# Altium schematic sheet [1] Power_Stage.SchDoc
size A4; SheetNumber: 2; SheetTotal: 5
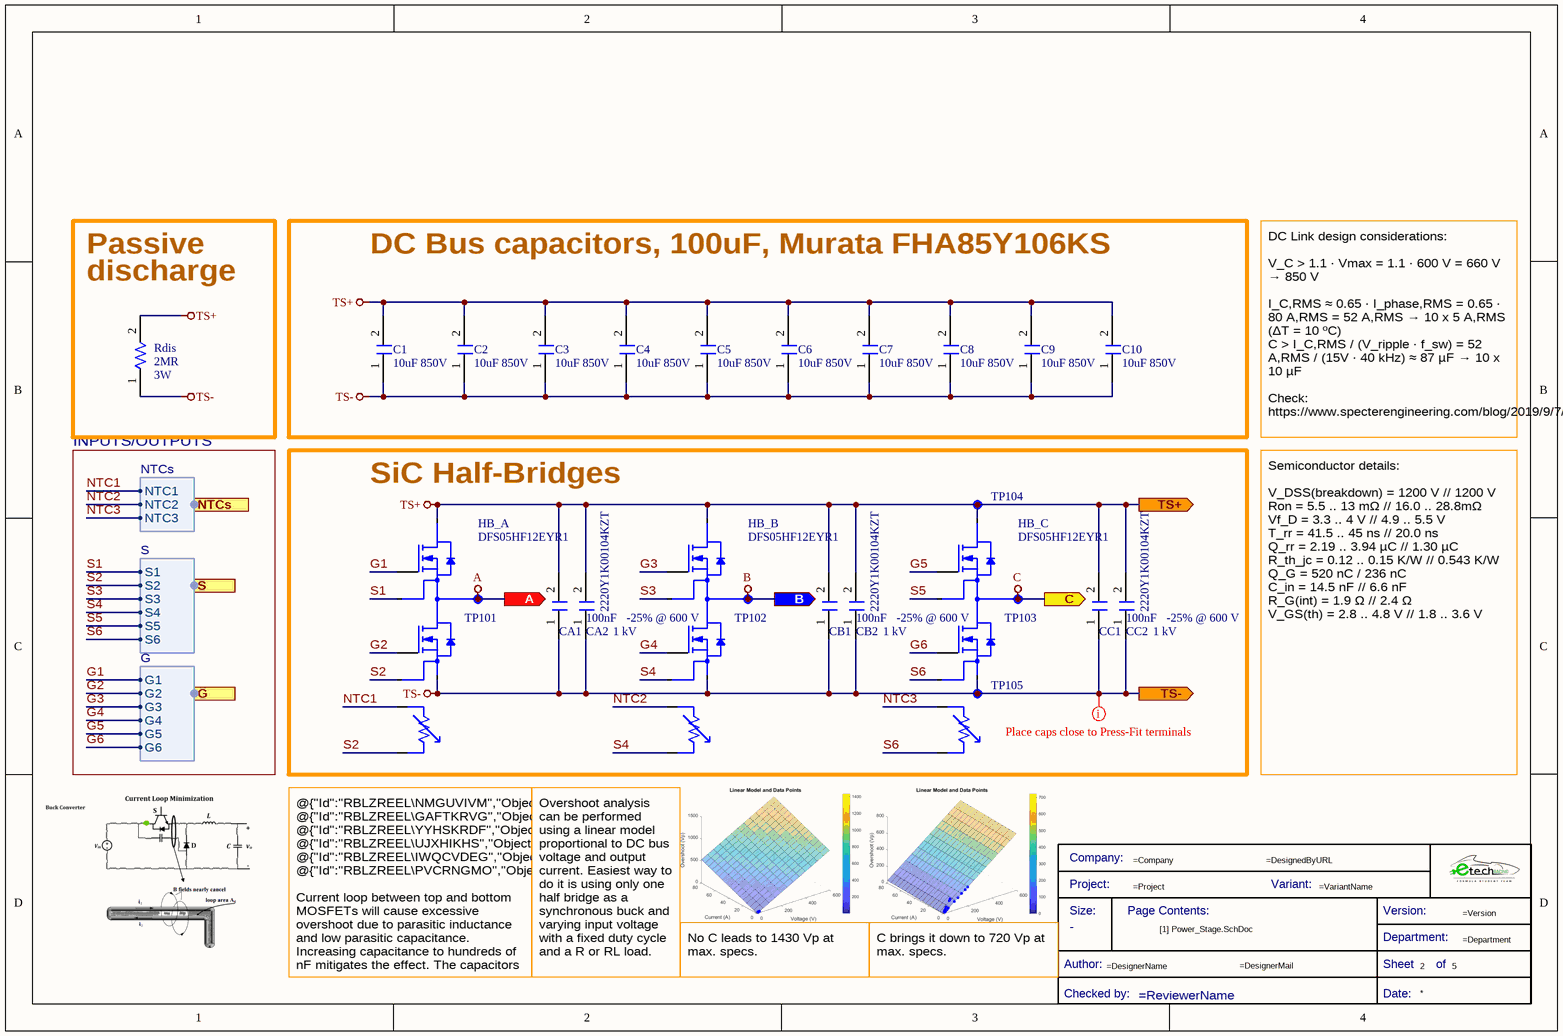
[diagram p0: [1] Power_Stage.SchDoc]

## Parts
*?  Title Block_template  (value not drawn)  (graphical)
C1  10uF 850V  [FHA85Y106KS]
C2  10uF 850V  [FHA85Y106KS]
C3  10uF 850V  [FHA85Y106KS]
C4  10uF 850V  [FHA85Y106KS]
C5  10uF 850V  [FHA85Y106KS]
C6  10uF 850V  [FHA85Y106KS]
C7  10uF 850V  [FHA85Y106KS]
C8  10uF 850V  [FHA85Y106KS]
C9  10uF 850V  [FHA85Y106KS]
C10  10uF 850V  [FHA85Y106KS]
CA1  2220Y1K00104KZT  [CAP_2220]  (value not drawn)
CA2  2220Y1K00104KZT  value 100nF  DC bias: -25% @ 600 V  Voltage rating: 1 kV  [CAP_2220]
CB1  2220Y1K00104KZT  [CAP_2220]  (value not drawn)
CB2  2220Y1K00104KZT  value 100nF  DC bias: -25% @ 600 V  Voltage rating: 1 kV  [CAP_2220]
CC1  2220Y1K00104KZT  [CAP_2220]  (value not drawn)
CC2  2220Y1K00104KZT  value 100nF  DC bias: -25% @ 600 V  Voltage rating: 1 kV  [CAP_2220]
HB_A  DFS05HF12EYR1  [DFS05HF12EYR1]
HB_B  DFS05HF12EYR1  [DFS05HF12EYR1]
HB_C  DFS05HF12EYR1  [DFS05HF12EYR1]
Rdis  Power Rating: 3W  Resistance: 2MR  [R2512FTK]  (hidden comment: R2M-2512FTK)
TP101  TestPoint  [TestPoint]  (value not drawn)  (no BOM)
TP102  TestPoint  [TestPoint]  (value not drawn)  (no BOM)
TP103  TestPoint  [TestPoint]  (value not drawn)  (no BOM)
TP104  TestPoint  [TestPoint]  (value not drawn)  (no BOM)
TP105  TestPoint  [TestPoint]  (value not drawn)  (no BOM)

## Blocks framed on the sheet
DC Bus capacitors, 100uF, Murata FHA85Y106KS: C1-C10
SiC Half-Bridges: CA1 CA2 CB1 CB2 CC1 CC2 HB_A HB_B HB_C TP101-TP105

## Ports
A (out, see Inverter_Power[3C], [2] Current_Sense[2A]), B (out, see Inverter_Power[3C], [2] Current_Sense[2B]), C (out, see Inverter_Power[3C], [2] Current_Sense[2C]), G (harness G, see Inverter_Power[3C], [3] Gate_Drivers[3A]), NTCs (harness NTCs, see Inverter_Power[3C], [3] Gate_Drivers[4A]), S (harness S, see Inverter_Power[3C], [3] Gate_Drivers[3A]), TS+ (out, see Inverter_Power[3C], [4] Half_Bridge[3A], [5] DC[1D]), TS- (out, see Inverter_Power[3C], [5] DC[1D])

## Harnesses
NTCs: NTC1, NTC2, NTC3
S: S1, S2, S3, S4, S5, S6
G: G1, G2, G3, G4, G5, G6

## Nets
A: HB_A.1(AC) TP101.1(TP) ; port A
B: HB_B.1(AC) TP102.1(TP) ; port B
C: HB_C.1(AC) TP103.1(TP) ; port C
TS+: C1.2 C2.2 C3.2 C4.2 C5.2 C6.2 C7.2 C8.2 C9.2 C10.2 CA1.2 CA2.2 CB1.2 CB2.2 CC1.2 CC2.2 HB_A.4(DC+) HB_B.4(DC+) HB_C.4(DC+) Rdis.2 TP104.1(TP) ; port TS+
TS-: C1.1 C2.1 C3.1 C4.1 C5.1 C6.1 C7.1 C8.1 C9.1 C10.1 CA1.1 CA2.1 CB1.1 CB2.1 CC1.1 CC2.1 HB_A.5(DC-) HB_B.5(DC-) HB_C.5(DC-) Rdis.1 TP105.1(TP) ; port TS-
G1: HB_A.6(G1) ; port G.G1
G2: HB_A.3(G2) ; port G.G2
G3: HB_B.6(G1) ; port G.G3
G4: HB_B.3(G2) ; port G.G4
G5: HB_C.6(G1) ; port G.G5
G6: HB_C.3(G2) ; port G.G6
NTC1: HB_A.9(T2) ; port NTCs.NTC1
NTC2: HB_B.9(T2) ; port NTCs.NTC2
NTC3: HB_C.9(T2) ; port NTCs.NTC3
S1: HB_A.7(S1) ; port S.S1
S2: HB_A.2(S2) HB_A.8(T1) ; port S.S2
S3: HB_B.7(S1) ; port S.S3
S4: HB_B.2(S2) HB_B.8(T1) ; port S.S4
S5: HB_C.7(S1) ; port S.S5
S6: HB_C.2(S2) HB_C.8(T1) ; port S.S6

## Layout directives
mark named Place caps close to Press-Fit terminals: TS-

## Notes on the sheet
- Passive
- discharge
- INPUTS/OUTPUTS
- DC Link design considerations:
  V_C > 1.1 · Vmax = 1.1 · 600 V = 660 V → 850 V
  I_C,RMS ≈ 0.65 · I_phase,RMS = 0.65 · 80 A,RMS = 52 A,RMS → 10 x 5 A,RMS (ΔT = 10 ºC)
  C > I_C,RMS / (V_ripple · f_sw) = 52 A,RMS / (15V · 40 kHz) ≈ 87 µF → 10 x 10 µF
  Check: https://www.specterengineering.com/blog/2019/9/7/dc-link-capacitor-selection-for-your-inverter
- Semiconductor details:
  V_DSS(breakdown) = 1200 V // 1200 V
  Ron = 5.5 .. 13 mΩ // 16.0 .. 28.8mΩ
  Vf_D = 3.3 .. 4 V // 4.9 .. 5.5 V
  T_rr = 41.5 .. 45 ns // 20.0 ns
  Q_rr = 2.19 .. 3.94 µC // 1.30 µC
  R_th_jc = 0.12 .. 0.15 K/W // 0.543 K/W
  Q_G = 520 nC / 236 nC
  C_in = 14.5 nF // 6.6 nF
  R_G(int) = 1.9 Ω // 2.4 Ω
  V_GS(th) = 2.8 .. 4.8 V // 1.8 .. 3.6 V
- (near HB_A) @{"Id":"RBLZREEL\NMGUVIVM","ObjectType":2}, @{"Id":"RBLZREEL\GAFTKRVG","ObjectType":2}, @{"Id":"RBLZREEL\YYHSKRDF","ObjectType":2}, @{"Id":"RBLZREEL\UJXHIKHS","ObjectType":2}, @{"Id":"RBLZREEL\IWQCVDEG","ObjectType":2}, @{"Id":"RBLZREEL\PVCRNGMO","ObjectType":2}
  Current loop between top and bottom MOSFETs will cause excessive overshoot due to parasitic inductance and low parasitic capacitance. Increasing capacitance to hundreds of nF mitigates the effect. The capacitors essentially work as a switching decoupling. MLCCs with low DC bias or film, but MLCCs are way more compact. Place as close as possible to semiconductor terminals.
- (near HB_B) Overshoot analysis can be performed using a linear model proportional to DC bus voltage and output current. Easiest way to do it is using only one half bridge as a synchronous buck and varying input voltage with a fixed duty cycle and a R or RL load.
- No C leads to 1430 Vp at max. specs.
- (near *?) C brings it down to 720 Vp at max. specs.
- (in symbol Title Block_template) Company:; Project:; Variant:; Size:; Page Contents:; Version:; Department:; Author:; Sheet; of; Checked by:; Date:

## Library data of the parts
*? = Title Block_template: Standard Title Block; .Creator: GP; Category: Title Block; .PCBcheck: GP; .SCHcheck: GP; Checked by:: =ReviewerName; Size: -
C1-C10 = FHA85Y106KS: High Temperature Film Capacitor for Automotive Application
CA1 CB1 CC1 = 2220Y1K00104KZT: 100NF 2220 Case Size 1000V Ceram; Manufacturer: Knowles Syfer; DC bias: -25% @ 600 V; Voltage rating: 1 kV; Footprint: 2220; Supplier: Digikey; Supplier Part Number: 1608-2220Y1K00104KZTCT-ND; RoHS: No; Category: Ceramic Capacitors; Stock: 650; Pricing: 1=5,53, 10=4,753, 50=4,3112, 100=3,5595 (USD); Manufacturer Part Number: 2220Y1K00104KZT; Value: 100nF
CA2 CB2 CC2 = 2220Y1K00104KZT: 100NF 2220 Case Size 1000V Ceram; Manufacturer: Knowles Syfer; Footprint: 2220; Supplier: Digikey; Supplier Part Number: 1608-2220Y1K00104KZTCT-ND; RoHS: No; Category: Ceramic Capacitors; Stock: 650; Pricing: 1=5,53, 10=4,753, 50=4,3112, 100=3,5595 (USD); Manufacturer Part Number: 2220Y1K00104KZT
HB_A HB_B HB_C = DFS05HF12EYR1: 1200V/5.5mΩ Half Bridge SiC MOSFET Module; Blocking voltage: 1200 V; Rds(on): 5.5 mOhm .. 13 mOhm; Maximum junction temperature: 175 °C; Isolation voltage: 3.4 kV; Maximum VGSS: +21 V / -2 V; Maximum IDS-ISD: 150 A; NTC resistance @25 ºC: 5 kOhm; NTC B-value @50 ºC: 3375 K; VGS(th): 2.8 V .. 4.8 V; QG: 520 nC; RGint: 1.9 Ohm; Rth(j-c): 0.12 K/W; Vf_diode: 3.3 V .. 4.0 V; ComponentLink1Description: Datasheet; ComponentLink1URL: https://www.leapers-power.com/action/download?file=/web/uploads/file/20230309/E66B0Y1w3x716fyKzgl84X9Kg38sCV40.pdf
Rdis = R2M-2512FTK: Current Sense Resistors - SMD 3watts .002ohms 1%; Manufacturer: Vishay Dale; Manufacturer Part Number: WSLP25122L000FEA; Temperature Coefficient: 275ppm/°C; Supplier 1: Mouser; RoHS: Yes; Category: Chip SMD Resistors; Stock 1: 11994; Pricing 1: 1=1,07000, 10=1,07000, 50=1,07000, 100=1,07000, 1000=0,77100, 10000=0,75500 (USD); Mount: Surface Mount; Case/Package: 2512; Case Code (Imperial): 2512; Case Code (Metric): 6432; Weight: 0.001429oz; Size Code: 2512; Min Operating Temperature: -65°C; Max Operating Temperature: 170°C; Tolerance: 1%; Packaging: Tape and Reel; Resistor Type: Metal Strip; Package Quantity: 2000; Termination: SMD/SMT; Series: WSLP; Length: 6.4mm; Width: 3.2mm; Height: 0.635mm; RoHS Compliant: Yes; Lead Free: Lead Free; ComponentLink1URL: https://datasheet.ciiva.com/48527/wslp-48527354.pdf?src-supplier=Avnet; ComponentLink1Description: https://datasheet.ciiva.com/48527/wslp-48527354.pdf?src-supplier=Avnet; Supplier Part Number 1: 71-WSLP25122L000FEA
TP101-TP105 = TestPoint: Test Point 1x1 mm; .Creator: GP; Category: TestPoint; .PCBcheck: GP; .SCHcheck: GP